# EAGLE design PLACA PROYECTO FINAL ELECTRONICA (EAGLE 9.5.1)
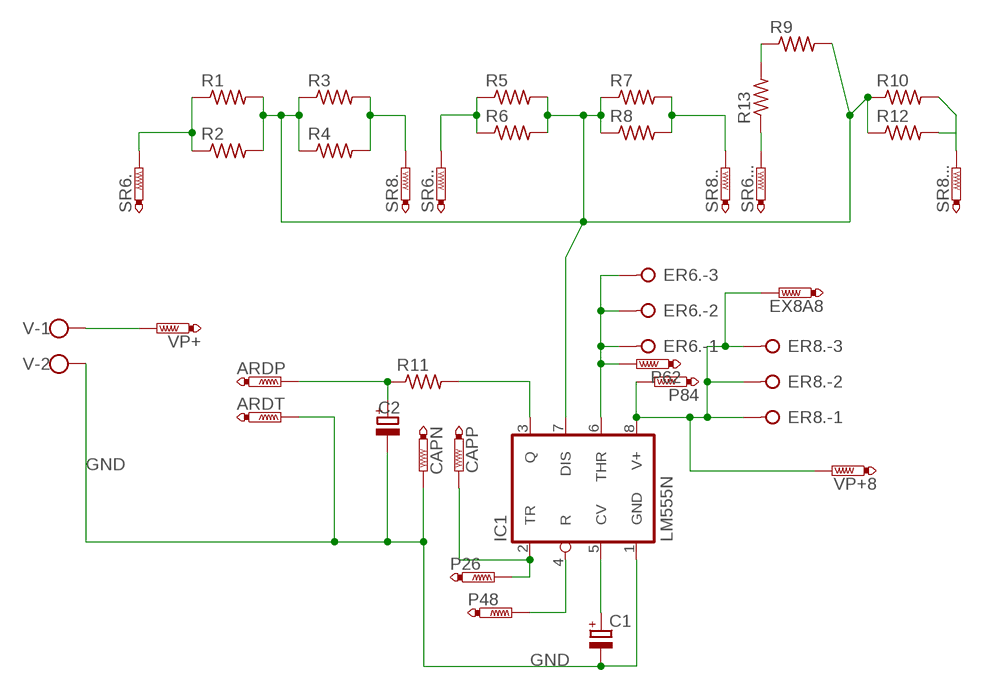
[diagram p0: schematic, sheet 1]

## Parts
ARDP  PTR1PAD1-17  [P1-17]
ARDT  PTR1PAD1-13  [P1-13]
C1  CPOL-EUE2,5-6E  [E2,5-6E]
C2  CPOL-EUE2,5-6E  [E2,5-6E]
CAPN  PTR1PAD1-17  [P1-17]
CAPP  PTR1PAD1-17  [P1-17]
ER6.  W237-3E  [W237-3E]
ER8.  W237-3E  [W237-3E]
EX8A8  PTR1PAD1-13  [P1-13]
IC1  LM555N  [DIL08]
P26  PTR1PAD1-17  [P1-17]
P48  PTR1PAD1-17  [P1-17]
P62  PTR1PAD1-17  [P1-17]
P84  PTR1PAD1-17  [P1-17]
R1  R-US_0204/7  [0204/7]
R2  R-US_0204/7  [0204/7]
R3  R-US_0204/7  [0204/7]
R4  R-US_0204/7  [0204/7]
R5  R-US_0204/7  [0204/7]
R6  R-US_0204/7  [0204/7]
R7  R-US_0204/7  [0204/7]
R8  R-US_0204/7  [0204/7]
R9  R-US_0204/7  [0204/7]
R10  R-US_0204/7  [0204/7]
R11  R-US_0204/7  [0204/7]
R12  R-US_0204/7  [0204/7]
R13  R-US_0204/7  [0204/7]
SR6.  PTR1PAD1-13  [P1-13]
SR6..  PTR1PAD1-13  [P1-13]
SR6...  PTR1PAD1-13  [P1-13]
SR8.  PTR1PAD1-13  [P1-13]
SR8..  PTR1PAD1-13  [P1-13]
SR8...  PTR1PAD1-13  [P1-13]
V  W237-102  [W237-102]
VP+  PTR1PAD1-13  [P1-13]
VP+8  PTR1PAD1-13  [P1-13]

## Nets
GND: ARDT.TP C1.- C2.- CAPN.TP IC1.1(GND) V.2
N$1: R10.2 R12.2 SR8....TP
N$2: R1.1 R2.1 SR6..TP
N$3: ER6..1 ER6..2 ER6..3 IC1.6(THR) P62.TP
N$4: R5.1 R6.1 SR6...TP
N$5: ER8..1 ER8..2 ER8..3 EX8A8.TP IC1.8(V+) P84.TP VP+8.TP
N$6: R9.1 R13.2
N$7: IC1.3(Q) R11.2
N$8: CAPP.TP IC1.2(TR) P26.TP
N$9: ARDP.TP C2.+ R11.1
N$10: C1.+ IC1.5(CV)
N$11: V.1 VP+.TP
N$12: IC1.7(DIS) R1.2 R2.2 R3.1 R4.1 R5.2 R6.2 R7.1 R8.1 R9.2 R10.1 R12.1
N$13: IC1.4(R) P48.TP
N$14: R3.2 R4.2 SR8..TP
N$15: R7.2 R8.2 SR8...TP
N$16: R13.1 SR6....TP

## Library data of the parts
ARDP ARDT CAPN CAPP EX8A8 P26 P48 P62 P84 SR6. SR6.. SR6... SR8. SR8.. SR8... VP+ VP+8 = testpad:PTR1: TEST PIN
C1 C2 = rcl:CPOL-EU: POLARIZED CAPACITOR, European symbol; SPICEPREFIX: C
ER6. ER8. = con-wago-508:W237-3E: WAGO SREW CLAMP; OC_FARNELL: unknown; OC_NEWARK: unknown
IC1 = linear:*555: TIMER
R1-R13 = rcl:R-US_: RESISTOR, American symbol; SPICEPREFIX: R
V = con-wago-500:W237-102: WAGO SCREW CLAMP; MPN: 237-102; OC_FARNELL: unknown; OC_NEWARK: 70K9898

## Board
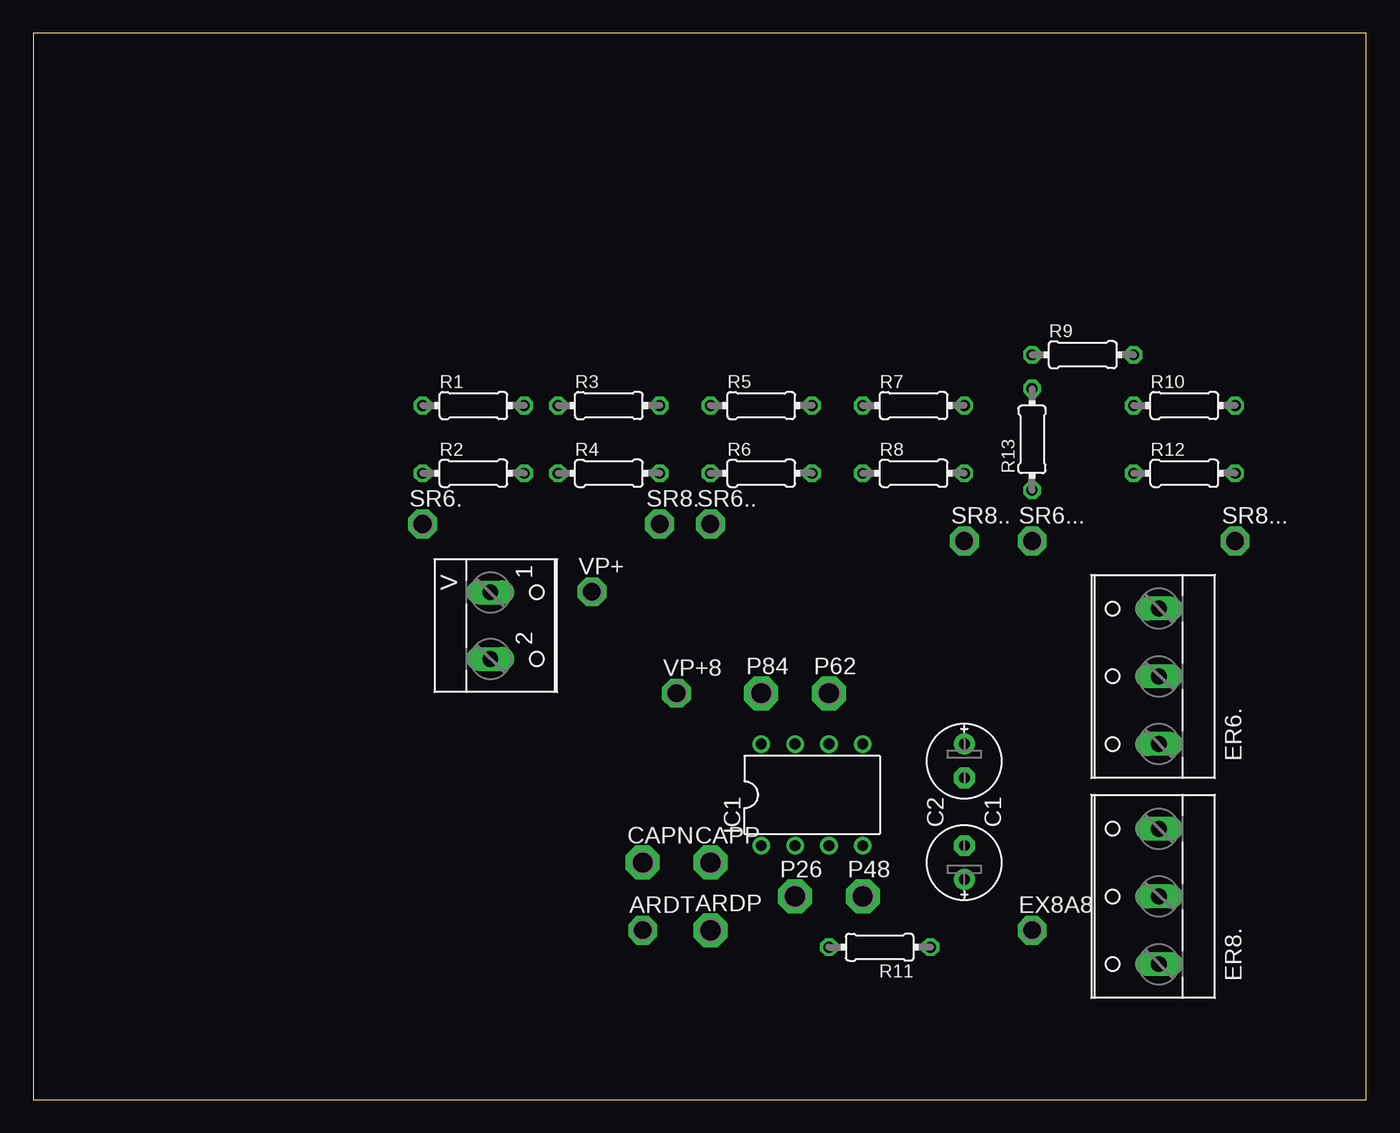
[diagram p1: board, top side]
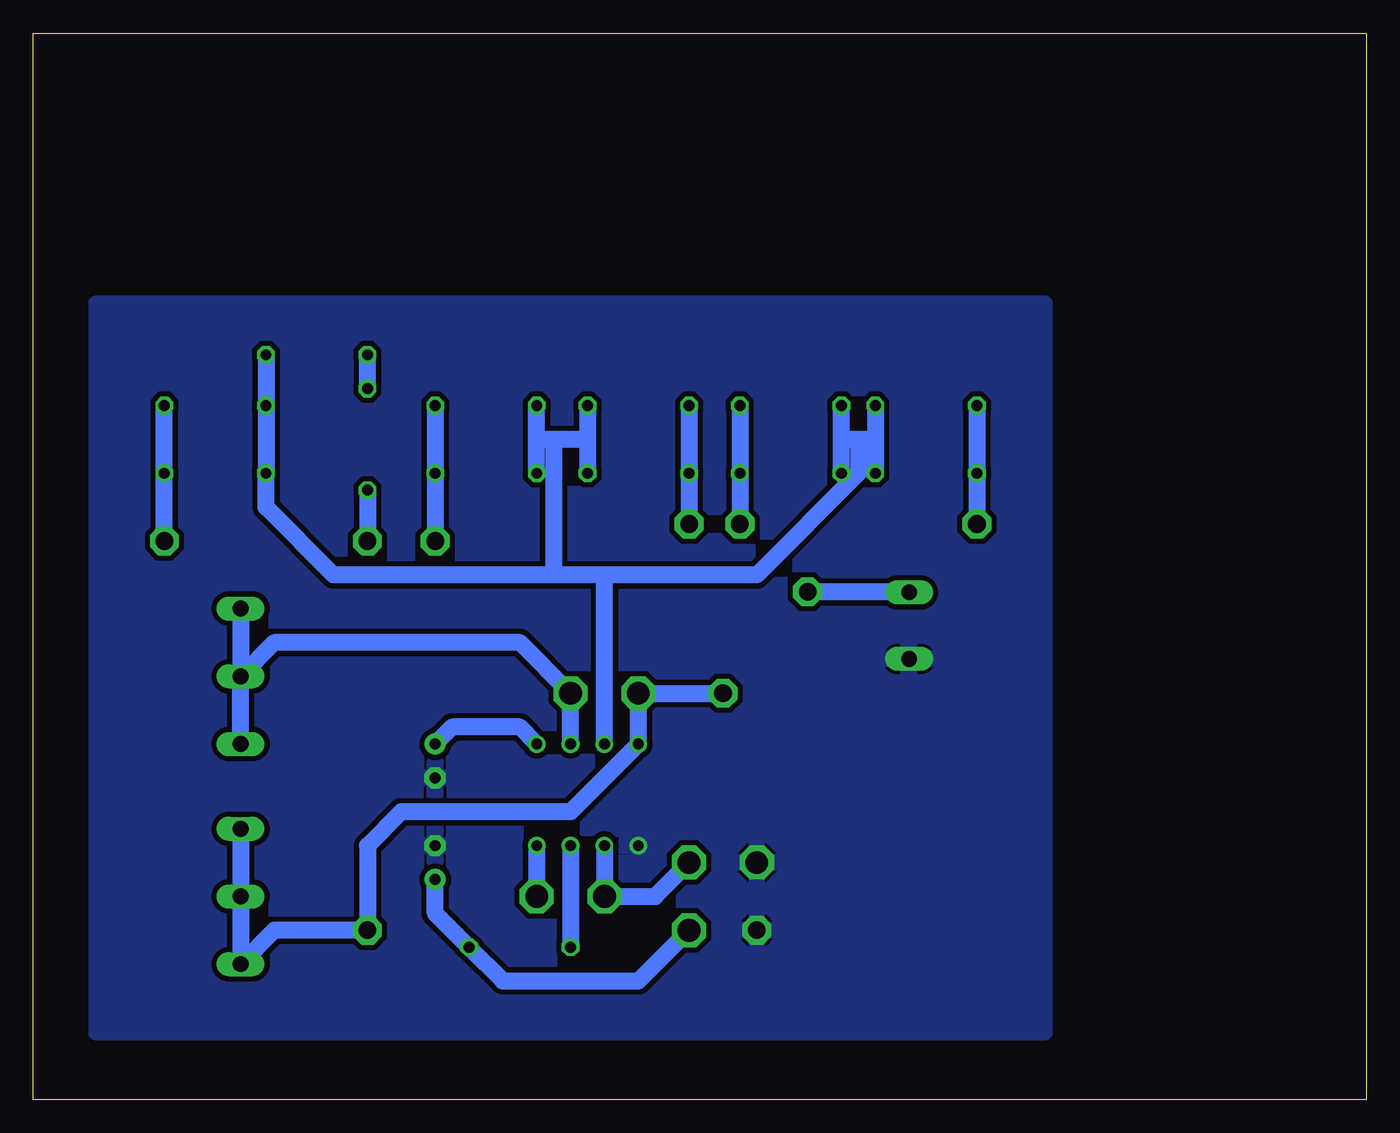
[diagram p2: board, bottom side, seen from below]

Size 100 x 80 mm. Coordinates in mm from the lower left corner, seen from the top.
Outline: 0,0 100,0 100,80 0,80 0,0
Copper layers (1*16): Top 0.035mm / dielectric 1.5mm / Bottom 0.035mm
Design rules "default *": minimum track width 6mil, minimum drill 0.35mm, track to track 0.4mm, track to pad 0.4mm, pad to pad 0.4mm, via to via 0.4mm, smd to smd 0.4mm, copper to edge 40mil, drill to drill 6mil, minimum pad ring 10mil, minimum via ring 8mil, stop-mask expansion 4mil, vias tented up to drill 0mil, thermal gap 10mil

### Footprints (pad centres in the part's own frame; a part is rotated, then mirrored left to right if it is on the bottom)
P1-17 = drill 1.702 pad 2.54 octagon: TP 0,0
P1-13 = drill 1.321 pad 2.159 octagon: TP 0,0
E2,5-6E = drill 0.813 pad 1.575: + -1.27,0 | drill 0.813 pad 1.575 octagon: - 1.27,0
W237-3E = drill 1.194 long: 1 -5.08,-0.635; 2 0,-0.635; 3 5.08,-0.635
DIL08 = drill 0.813 pad 1.27: 1 -3.81,-3.81; 2 -1.27,-3.81; 3 1.27,-3.81; 4 3.81,-3.81; 5 3.81,3.81; 6 1.27,3.81; 7 -1.27,3.81; 8 -3.81,3.81
0204/7 = drill 0.813 octagon: 1 -3.81,0; 2 3.81,0
W237-102 = drill 1.194 long: 1 -2.5,-1.27; 2 2.5,-1.27

### Placement (x,y rotation side)
ARDP  50.8,12.7 0 top
ARDT  45.72,12.7 0 top
C1  69.85,25.4 270 top
C2  69.85,17.78 90 top
CAPN  45.72,17.78 0 top
CAPP  50.8,17.78 0 top
ER6.  83.82,31.75 90 top
ER8.  83.82,15.24 90 top
EX8A8  74.93,12.7 0 top
IC1  58.42,22.86 0 top
P26  57.15,15.24 0 top
P48  62.23,15.24 0 top
P62  59.69,30.48 0 top
P84  54.61,30.48 0 top
R1  33.02,52.07 0 top
R2  33.02,46.99 0 top
R3  43.18,52.07 0 top
R4  43.18,46.99 0 top
R5  54.61,52.07 0 top
R6  54.61,46.99 0 top
R7  66.04,52.07 0 top
R8  66.04,46.99 0 top
R9  78.74,55.88 0 top
R10  86.36,52.07 0 top
R11  63.5,11.43 180 top
R12  86.36,46.99 0 top
R13  74.93,49.53 90 top
SR6.  29.21,43.18 0 top
SR6..  50.8,43.18 0 top
SR6...  74.93,41.91 0 top
SR8.  46.99,43.18 0 top
SR8..  69.85,41.91 0 top
SR8...  90.17,41.91 0 top
V  35.56,35.56 270 top
VP+  41.91,38.1 0 top
VP+8  48.26,30.48 0 top

### Tracks (layer width: path | path; a pad name or v marks a point on that pad's centre or on a via)
GND
  pour Bottom: 24.13,59.69 95.25,59.69 95.25,5.08 24.13,5.08
N$1
  Bottom 1.27: R10.2 R12.2 SR8....TP
N$2
  Bottom 1.27: R1.1 R2.1 SR6..TP
N$3
  Bottom 1.27: ER6..3 ER6..2 | ER6..1 ER6..2 | IC1.6 P62.TP 63.5,34.29 81.91,34.29 ER6..2
N$4
  Bottom 1.27: R5.1 R6.1 SR6...TP
N$5
  Bottom 1.27: VP+8.TP P84.TP IC1.8 59.69,21.59 72.39,21.59 74.93,19.05 EX8A8.TP 81.91,12.7 ER8..1 ER8..2 ER8..3
N$6
  Bottom 1.27: R13.2 R9.1
N$7
  Bottom 1.27: IC1.3 R11.2
N$8
  Bottom 1.27: IC1.2 P26.TP 53.34,15.24 CAPP.TP
N$9
  Bottom 1.27: C2.+ 69.85,13.97 R11.1 64.77,8.89 54.61,8.89 ARDP.TP
N$10
  Bottom 1.27: IC1.5 63.5,27.94 68.58,27.94 C1.+
N$11
  Bottom 1.27: V.1 34.33,38.1 VP+.TP
N$12
  Bottom 1.27: R1.2 36.83,49.53 | 36.83,49.53 R2.2 | 36.83,49.53 38.1,49.53 | 38.1,49.53 39.37,49.53 | 39.37,49.53 R3.1 | R4.1 39.37,49.53 | R5.2 58.42,49.53 | 58.42,49.53 R6.2 | 58.42,49.53 60.96,49.53 | 60.96,49.53 62.23,49.53 | 62.23,49.53 R7.1 | R8.1 62.23,49.53 | R9.2 R10.1 R12.1 82.55,44.45 77.47,39.37 60.96,39.37 | 38.1,49.53 38.1,46.99 45.72,39.37 57.15,39.37 | 57.15,39.37 60.96,39.37 | 60.96,49.53 60.96,39.37 | IC1.7 57.15,39.37
N$13
  Bottom 1.27: IC1.4 P48.TP
N$14
  Bottom 1.27: R3.2 R4.2 SR8..TP
N$15
  Bottom 1.27: R7.2 R8.2 SR8...TP
N$16
  Bottom 1.27: R13.1 SR6....TP